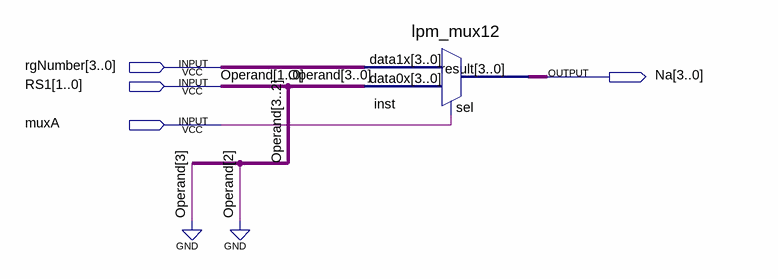
[diagram p0: schematic sheet]
// Quartus schematic muxA.bdf as structural Verilog: 1 symbols, 4 pins
module muxA (
  input  [3:0] rgNumber,
  input  [1:0] RS1,
  input  muxA,
  output [3:0] Na
);

  lpm_mux12 inst (.data1x(rgNumber), .data0x({2'b00, RS1}), .sel(muxA), .result(Na));

  // Other names for the same wires on the sheet: Operand[1:0] = RS1
endmodule
